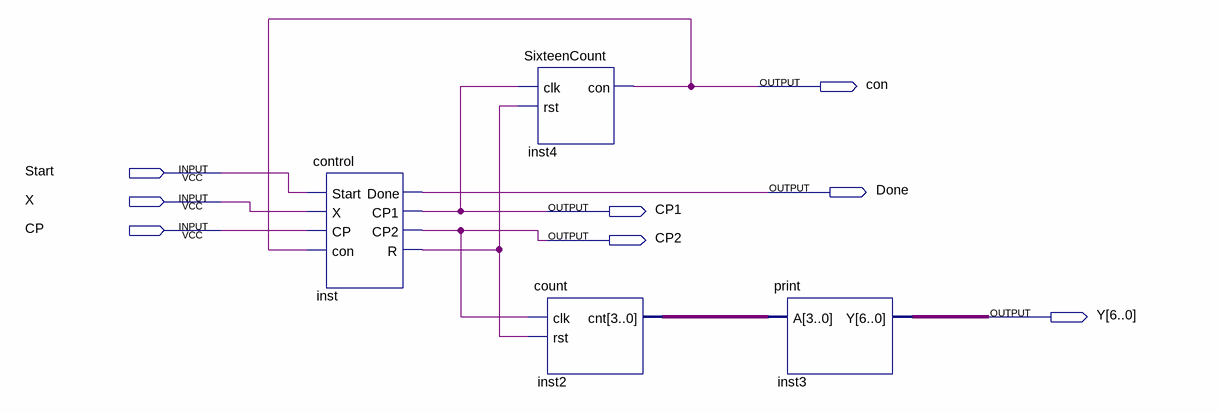
[diagram p0: schematic sheet]
// Quartus schematic demo.bdf as structural Verilog: 4 symbols, 8 pins
module demo (
  input  Start,
  input  X,
  input  CP,
  output con,
  output Done,
  output CP1,
  output CP2,
  output [6:0] Y
);

  wire inst_r;
  wire [3:0] inst2_cnt;

  control inst (.Start(Start), .X(X), .CP(CP), .con(con), .Done(Done), .CP1(CP1), .CP2(CP2), .R(inst_r));
  SixteenCount inst4 (.clk(CP1), .rst(inst_r), .con(con));
  count inst2 (.clk(CP2), .rst(inst_r), .cnt(inst2_cnt));
  print inst3 (.A(inst2_cnt), .Y(Y));
endmodule
